# EAGLE design pcb_balun_bottom_notch (EAGLE 9.6.2)
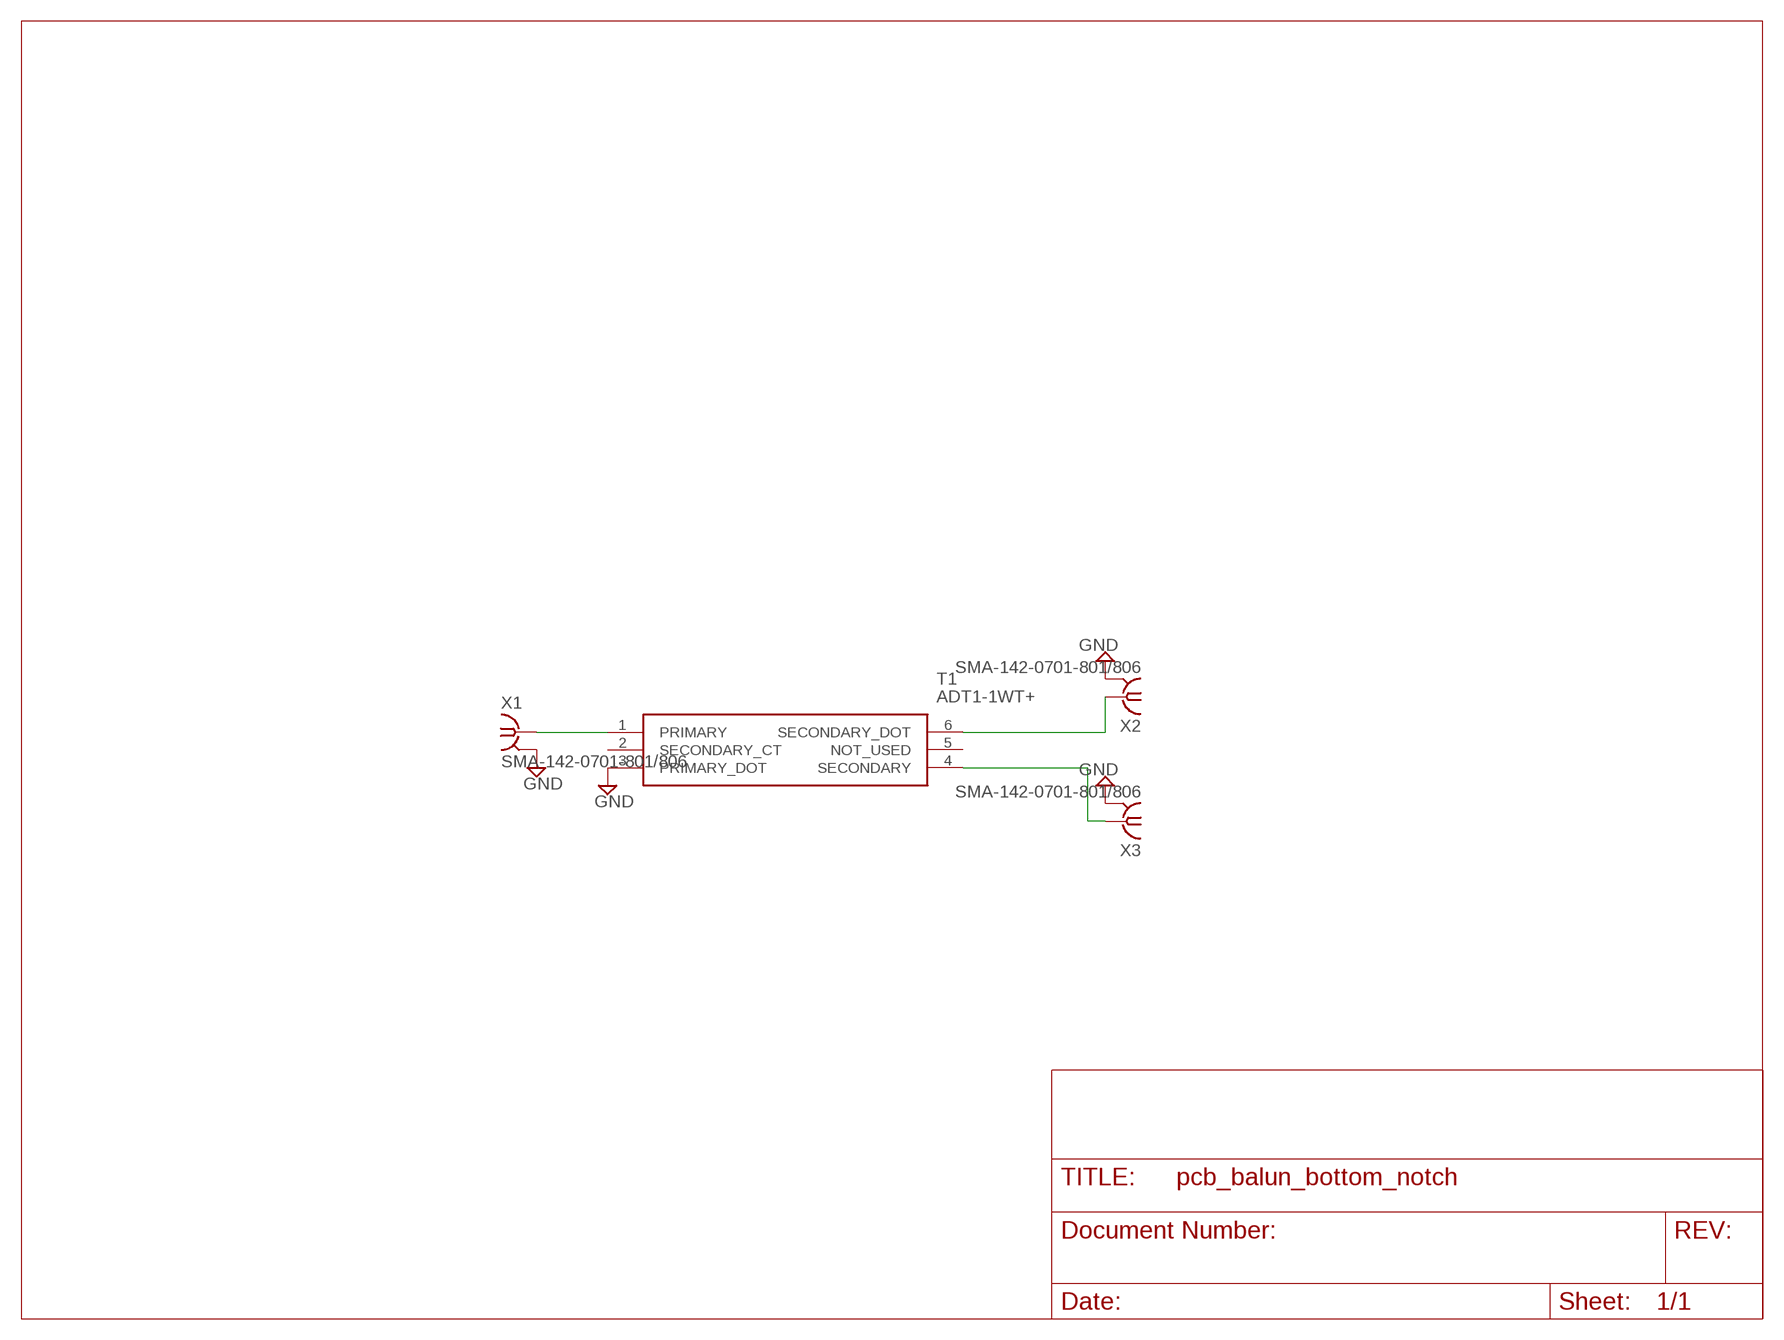
[diagram p0: schematic, sheet 1]

## Parts
T1  ADT1-1WT+  [ADT11WT]
X1  SMA-142-0701-801/806  [J502-ND-142-0701-801/806]
X2  SMA-142-0701-801/806  [J502-ND-142-0701-801/806]
X3  SMA-142-0701-801/806  [J502-ND-142-0701-801/806]

## Nets
GND: T1.3(PRIMARY_DOT) X1.G@1 X1.G@2 X1.G@3 X1.G@4 X2.G@1 X2.G@2 X2.G@3 X2.G@4 X3.G@1 X3.G@2 X3.G@3 X3.G@4
N$1: T1.1(PRIMARY) X1.1
N$2: T1.6(SECONDARY_DOT) X2.1
N$3: T1.4(SECONDARY) X3.1
Unconnected: T1.2(SECONDARY_CT) T1.5(NOT_USED)

## Library data of the parts
T1 = ADT1-1WT+:ADT1-1WT+: RF Transformer Source: Datasheet <https://www.minicircuits.com/pdfs/ADT1-1WT .pdf>; ARROW_PART_NUMBER: ADT1-1WT+; DESCRIPTION: RF Transformer; HEIGHT: 2.84mm; MANUFACTURER_NAME: Mini-Circuits; MANUFACTURER_PART_NUMBER: ADT1-1WT+; MOUSER_PART_NUMBER: 139-ADT1-1WT; MOUSER_PRICE-STOCK: https://www.mouser.co.uk/ProductDetail/Mini-Circuits/ADT1-1WT%2b?qs=xZ%2FP%252Ba9zWqYbLxnb6qhNYw%3D%3D
X1 = con-coax_flange_mount_edit:SMA-: SMA 50 Ohm End Launch Jack Receptacle - Round Contact Johnson Components Source: www.johnsoncomponents.com .. J502-ND.pdf; MF: JOHNSON COMPONENTS; MPN: 142-0701-801; OC_FARNELL: 1608592; OC_NEWARK: 90F2624
X2 X3 = con-coax:SMA-: SMA 50 Ohm End Launch Jack Receptacle - Round Contact Johnson Components Source: www.johnsoncomponents.com .. J502-ND.pdf; MF: JOHNSON COMPONENTS; MPN: 142-0701-801; OC_FARNELL: 1608592; OC_NEWARK: 90F2624

## Board
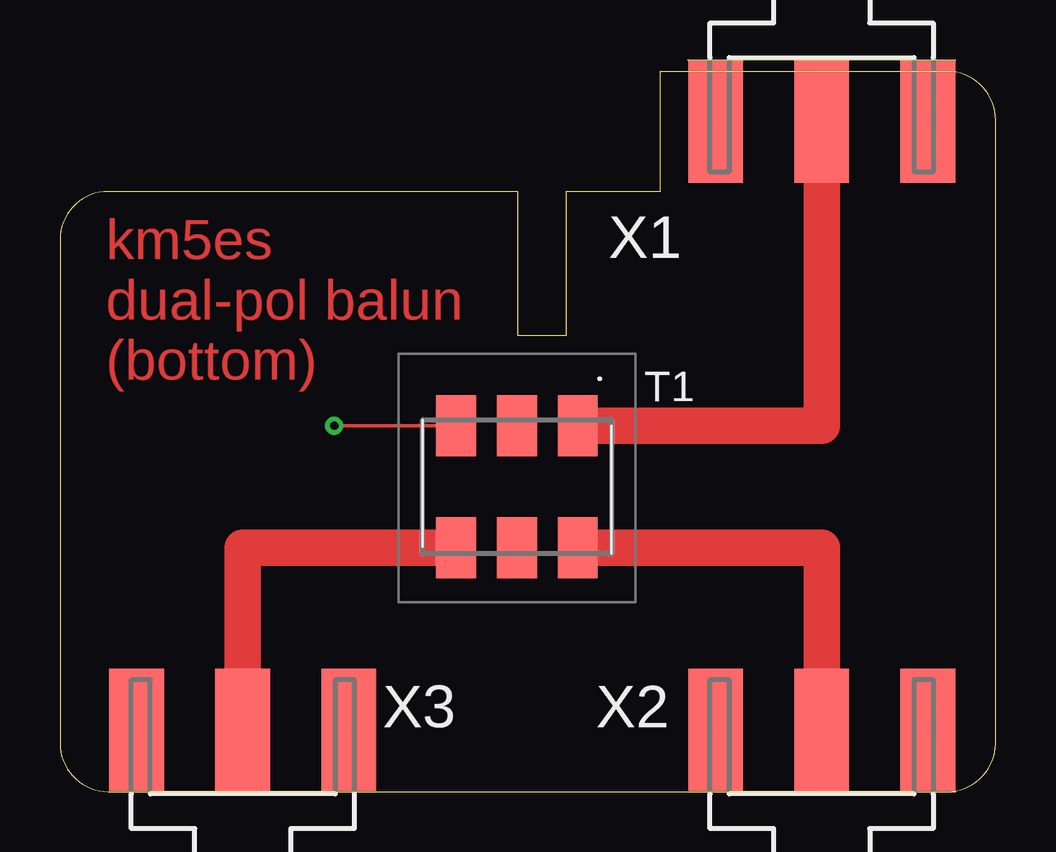
[diagram p1: board, top side]
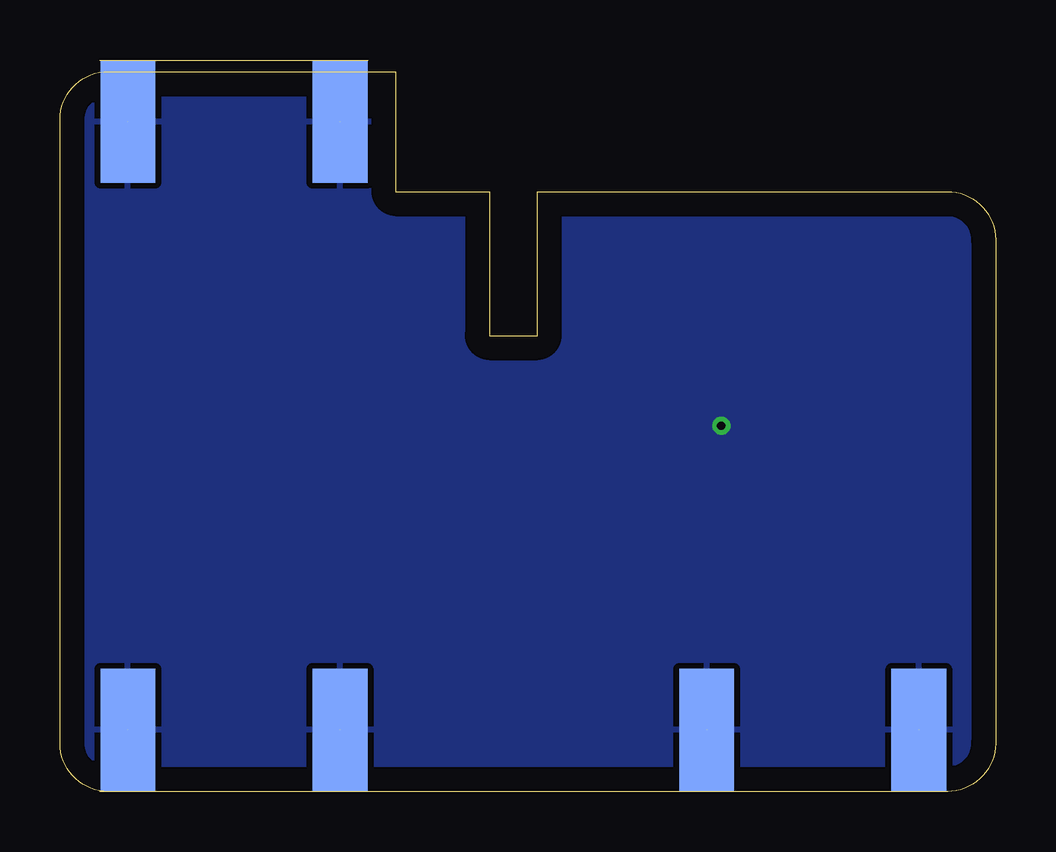
[diagram p2: board, bottom side, seen from below]

Size 39 x 30 mm. Coordinates in mm from the lower left corner, seen from the top.
Outline: 2,25 arc90 0,23 0,2 arc90 2,0 37,0 arc90 39,2 39,28 arc90 37,30 25,30 25,25 21.1,25 21.1,19 19.1,19 19.1,25 2,25
Copper layers (1*16): Top 0.035mm / dielectric 1.5mm / Bottom 0.035mm
Design rules "default": minimum track width 6mil, minimum drill 0.35mm, track to track 6mil, track to pad 6mil, pad to pad 6mil, via to via 6mil, smd to smd 6mil, copper to edge 40mil, drill to drill 6mil, minimum pad ring 10mil, minimum via ring 8mil, stop-mask expansion 4mil, vias tented up to drill 0mil, thermal gap 10mil

### Footprints (pad centres in the part's own frame; a part is rotated, then mirrored left to right if it is on the bottom)
ADT11WT = smd 1.65 x 2.54: 1 -2.54,-2.54; 2 0,-2.54; 3 2.54,-2.54; 4 2.54,2.54; 5 0,2.54; 6 -2.54,2.54
J502-ND-142-0701-801/806 = smd 5.08 x 2.286: 1 2.565,0; G@1 2.565,4.42; G@2 2.565,-4.42 | smd 5.08 x 2.286 bottom: G@3 2.565,4.42; G@4 2.565,-4.42

### Placement (x,y rotation side)
T1  19.05,12.7 180 top
X1  31.75,30.48 270 top
X2  31.75,0 90 top
X3  7.62,0 90 top

### Tracks (layer width: path | path; a pad name or v marks a point on that pad's centre or on a via)
GND  (via drill 0.35)  (6 unrouted)
  Top 0.152: T1.3 v11.43,15.24
  pour Bottom: 0,0 39.37,0 39.37,30.48 24.13,30.48 24.13,25.4 0,25.4
  pour Bottom: 0,0 39.37,0 39.37,30.48 25.4,30.48 25.4,25.4 20.32,25.4 20.32,19.05 19.05,19.05 19.05,24.13 19.05,25.4 0,25.4
N$1
  Top 1.524: X1.1 31.75,15.24 T1.1
N$2
  Top 1.524: T1.6 31.75,10.16 X2.1
N$3
  Top 1.524: T1.4 7.62,10.16 X3.1

### Text on the board
Top: km5es / dual-pol balun / (bottom)